# EasyEDA schematic sheet.json
TITLE: Sheet_1; REV: 1.0; Date: 2026-06-16; Sheet: 1/1; Drawn By: arnodeschepper12; Company: Your Company
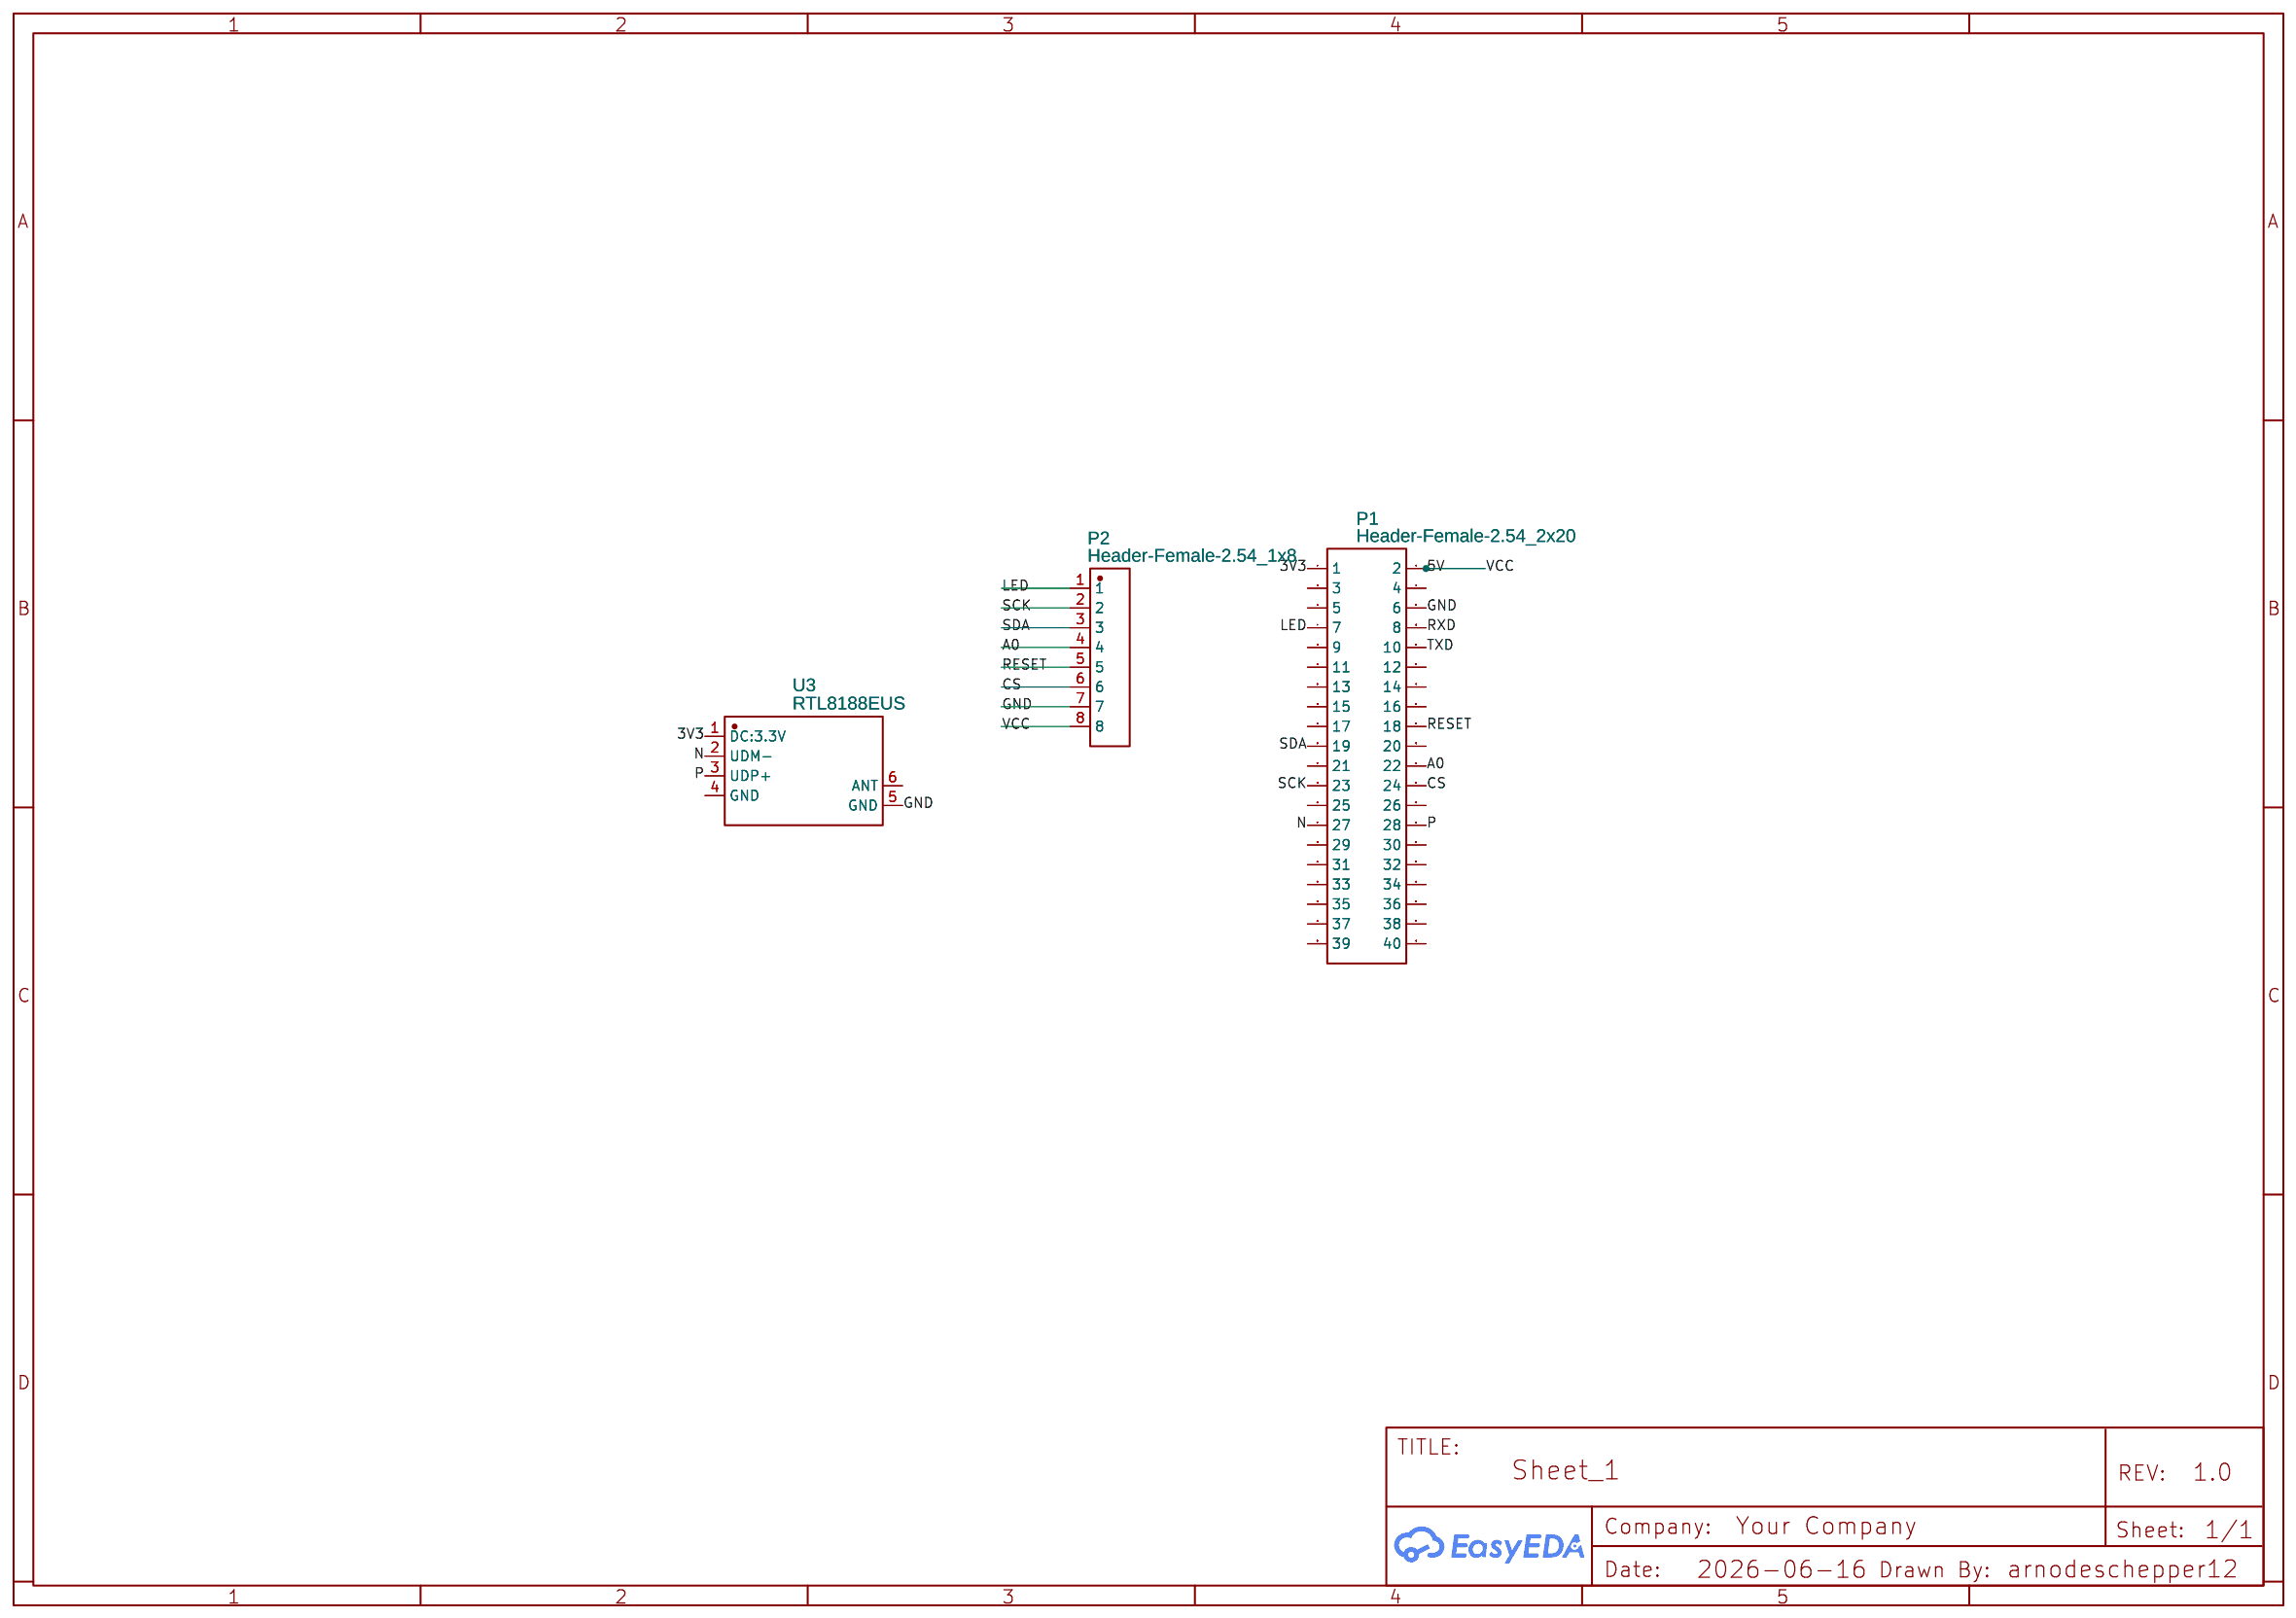
[diagram p0: schematic sheet]

## Parts
P1  Header-Female-2.54_2x20  [HDR-TH_40P-P2.54-V-F-R2-C20-S2.54]
P2  Header-Female-2.54_1x8  [HDR-TH_8P-P2.54-V-F]
U3  RTL8188EUS  [COMM-SMD_RTL8188EUS]

## Library data of the parts
P1 = Header-Female-2.54_2x20: Supplier: LCSC; Manufacturer: BOOMELE(博穆精密); Manufacturer Part: 2.54-2*20P母; Supplier Part: C50982; JLCPCB Part Class: Extended Part
P2 = Header-Female-2.54_1x8: Supplier: LCSC; Manufacturer: BOOMELE(博穆精密); Manufacturer Part: 2.54-1*8P母环保; Supplier Part: C27438; JLCPCB Part Class: Extended Part
U3 = RTL8188EUS: Contributor: lcsc; Supplier: LCSC; Supplier Part: C9900018197; Manufacturer: null; JLCPCB Part Class: Extended Part

## Nets
3V3: P1.1 U3.1(DC:3.3V)
5V: P1.2 P2.8
GND: P1.6 P2.7 U3.5(GND)
A0: P1.22 P2.4
CS: P1.24 P2.6
LED: P1.7 P2.1
N: P1.27 U3.2(UDM-)
P: P1.28 U3.3(UDP+)
RESET: P1.18 P2.5
RXD: P1.8
SCK: P1.23 P2.2
SDA: P1.19 P2.3
TXD: P1.10

Not connected (* = marked no-connect by the designer): P1 3 4 5 9 11 12 13 14 15 16 17 20 21 25 26 29 30 31 32 33 34 35 36 37 38 39 40; U3 4(GND) 6(ANT)
